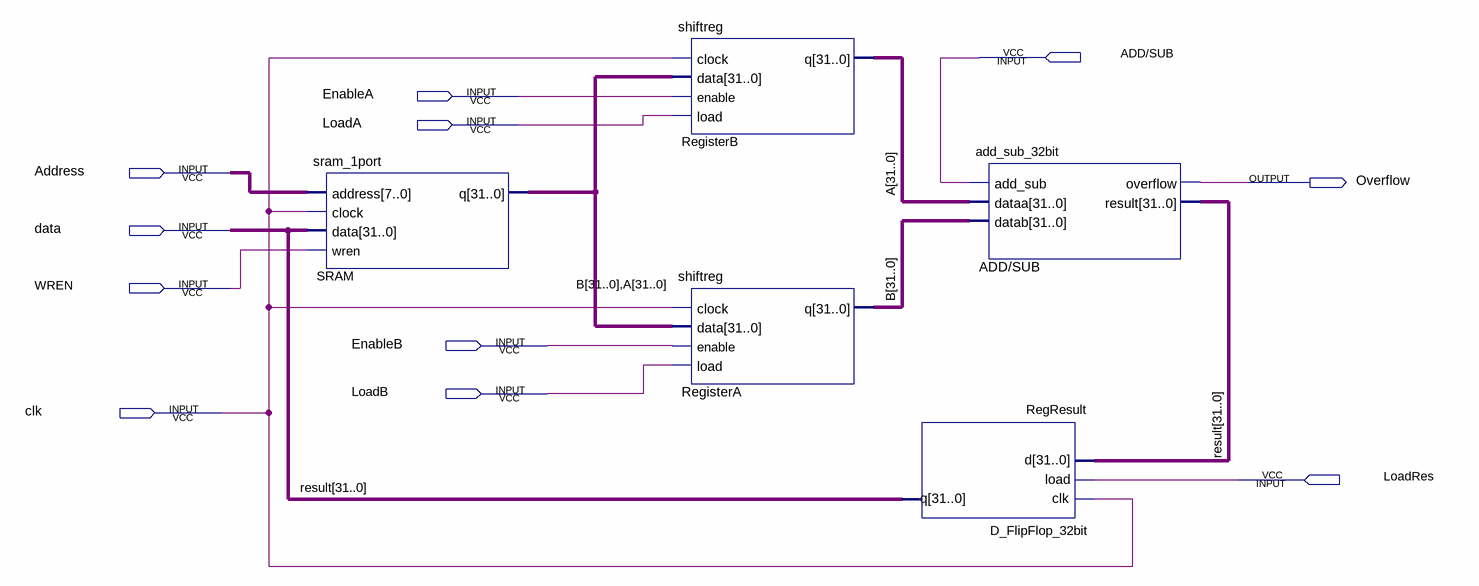
[diagram p0: schematic sheet]
// Quartus schematic add_sub.bdf as structural Verilog: 5 symbols, 11 pins
module add_sub (
  input  \ADD/SUB ,
  input  EnableA,
  input  LoadA,
  input  Address,
  input  data,
  input  WREN,
  input  EnableB,
  input  LoadB,
  input  clk,
  input  LoadRes,
  output Overflow
);

  wire [7:0] undriven;
  wire [31:0] A, B, result;

  sram_1port SRAM (.address(undriven), .clock(clk), .data(result), .wren(WREN), .q({B, A}));
  shiftreg RegisterB (.clock(clk), .data({B, A}), .enable(EnableA), .load(LoadA), .q(A));
  shiftreg RegisterA (.clock(clk), .data({B, A}), .enable(EnableB), .load(LoadB), .q(B));
  D_FlipFlop_32bit RegResult (.clk(clk), .load(LoadRes), .d(result), .q(result));
  add_sub_32bit \u_ADD/SUB  (.add_sub(\ADD/SUB ), .dataa(A), .datab(B), .overflow(Overflow), .result(result));
endmodule
